# Altium schematic sheet CH32V307VCT6-R2.SchDoc
size A2
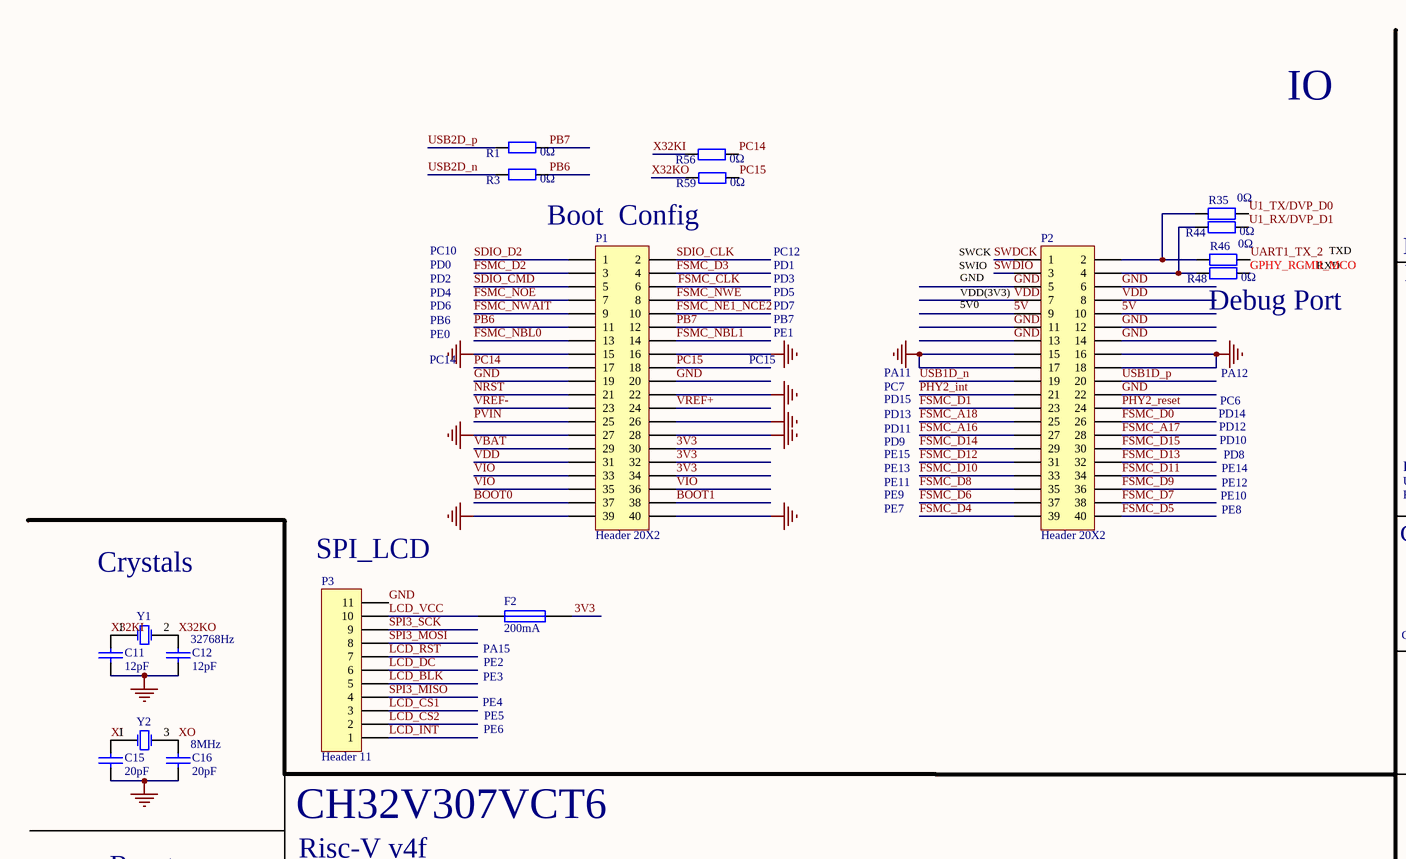
[diagram p0: CH32V307VCT6-R2.SchDoc, top left]
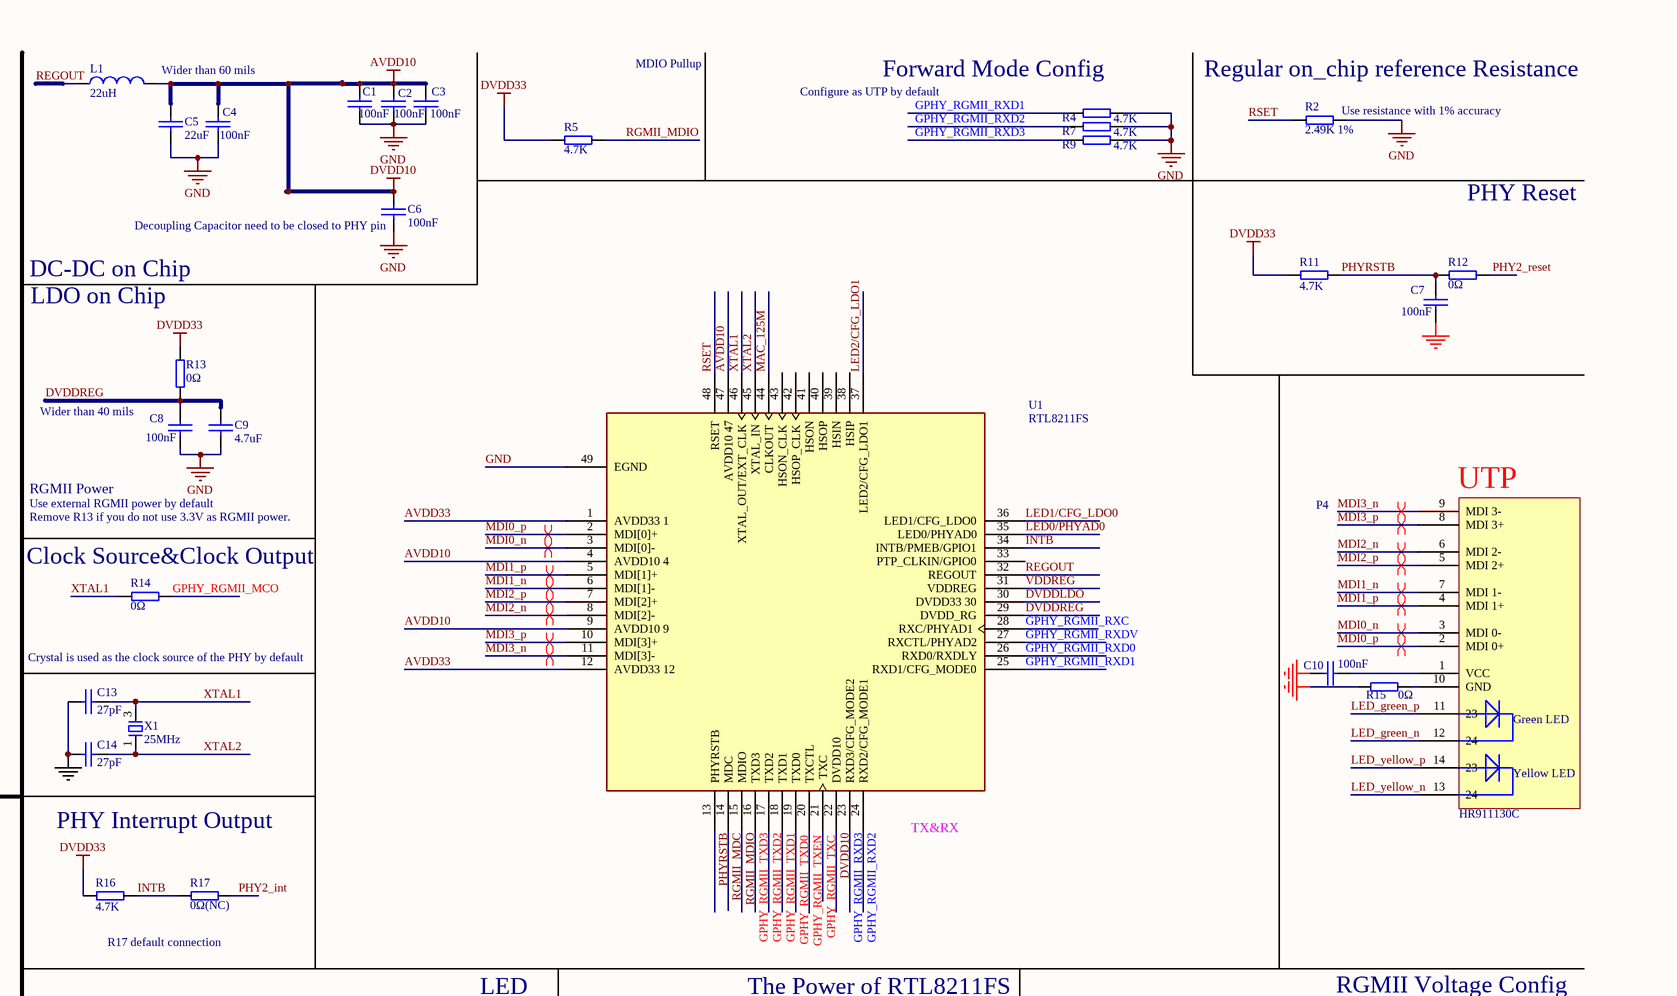
[diagram p1: CH32V307VCT6-R2.SchDoc, top right]
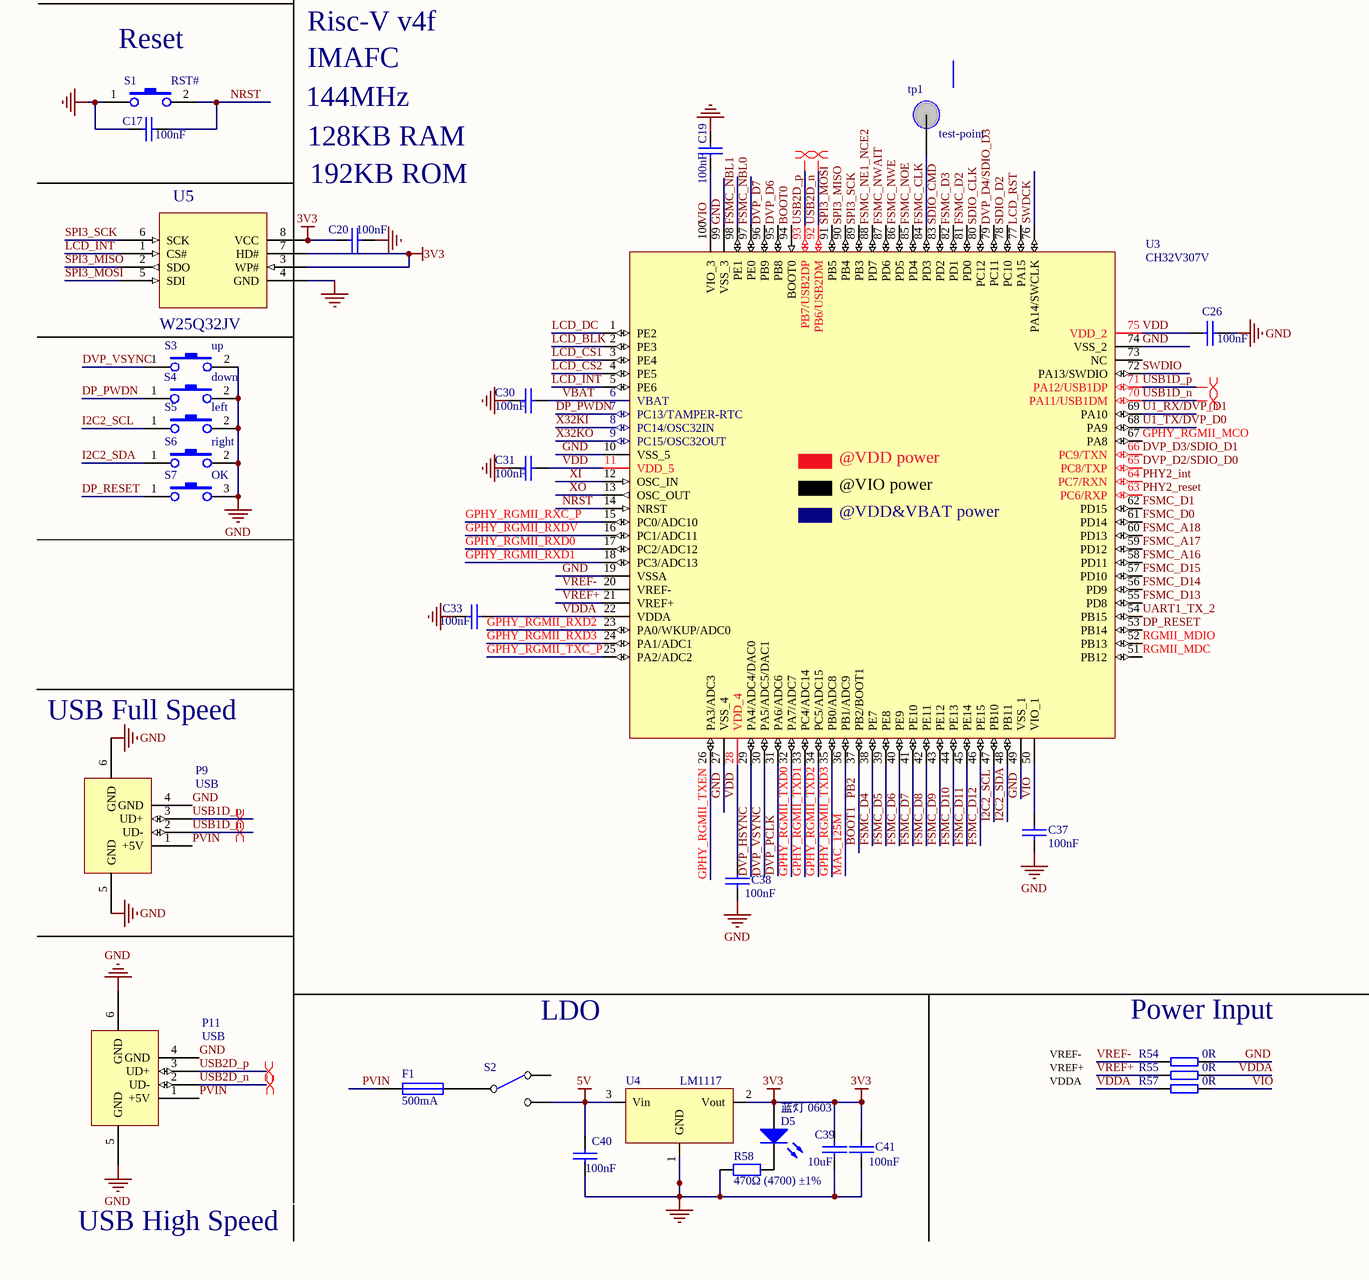
[diagram p2: CH32V307VCT6-R2.SchDoc, bottom left]
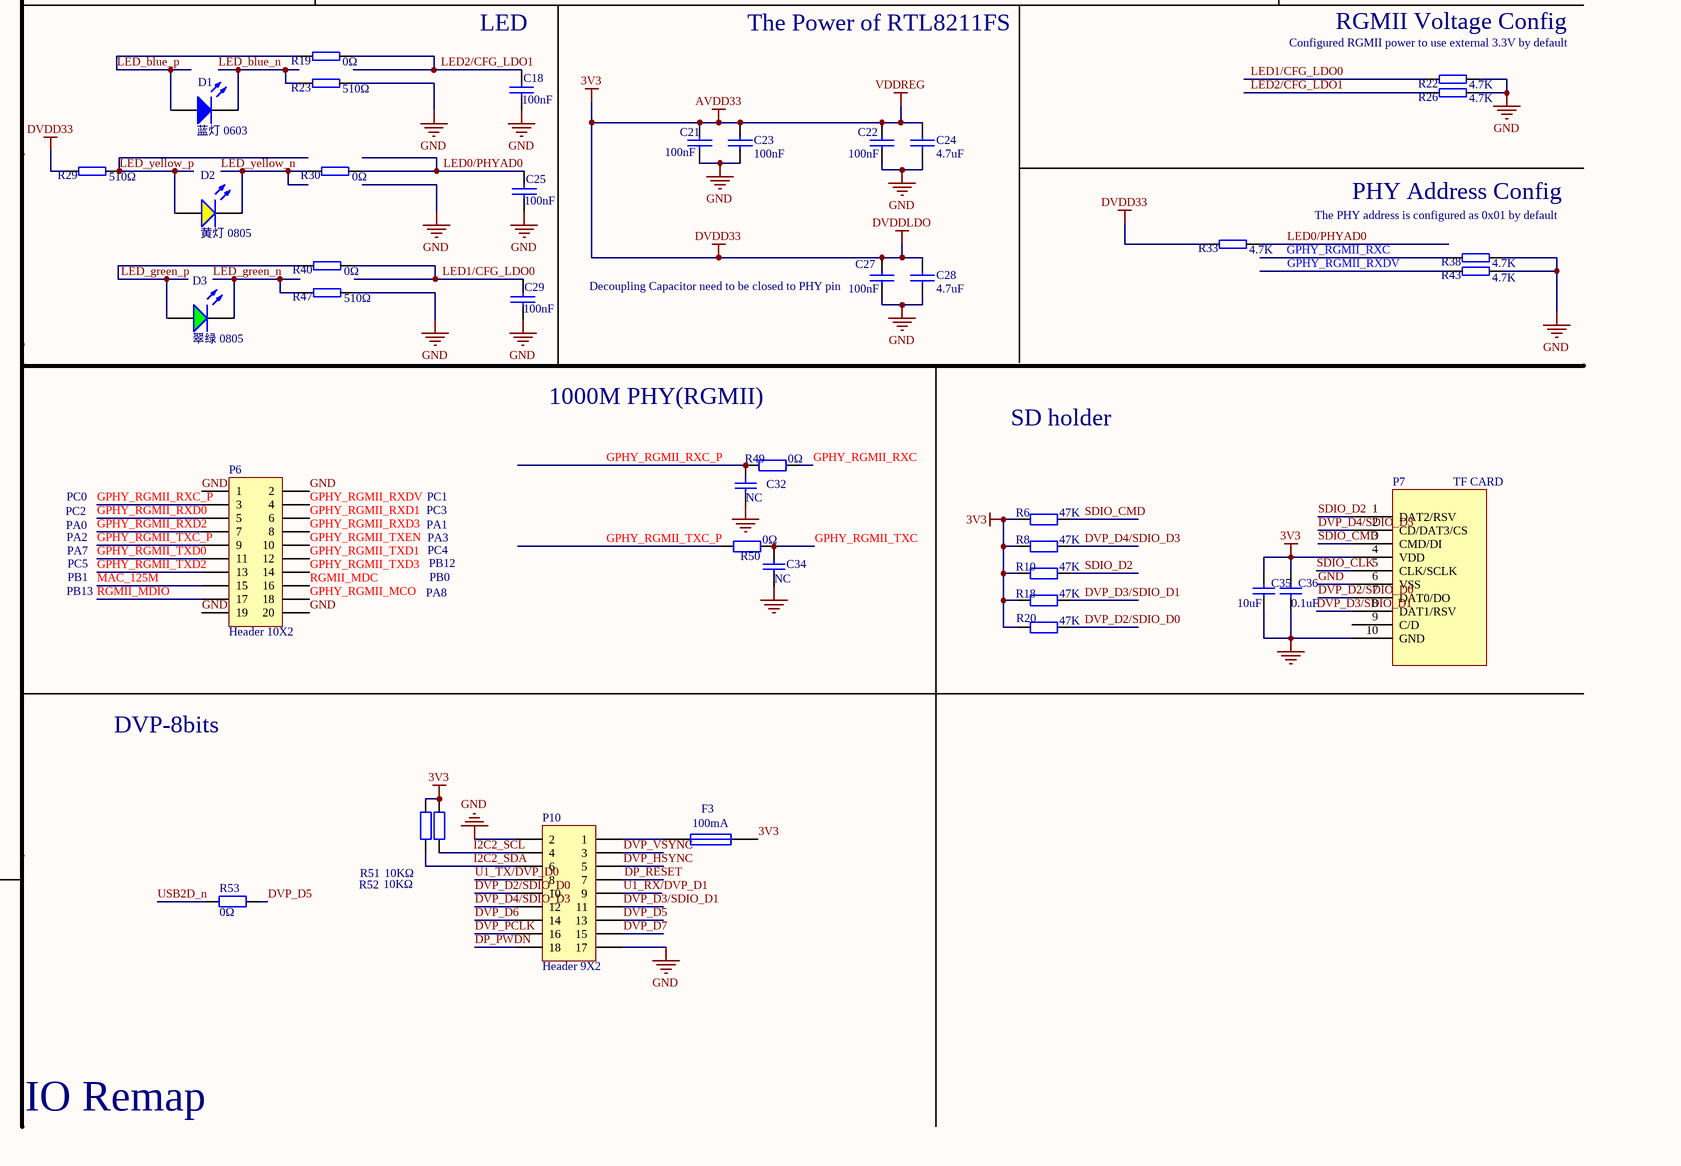
[diagram p3: CH32V307VCT6-R2.SchDoc, bottom right]

## Parts
C1  100nF  [0603_C]
C2  100nF  [0603_C]
C3  100nF  [0603_C]
C4  100nF  [0603_C]
C5  22uF  [0805_C]
C6  100nF  [0603_C]
C7  100nF  [0603_C]
C8  100nF  [0603_C]
C9  4.7uF  [0603_C]
C10  100nF  [0603_C]
C11  12pF  [0603_C]
C12  12pF  [0603_C]
C13  27pF  [0603_C]
C14  27pF  [0603_C]
C15  20pF  [0603_C]
C16  20pF  [0603_C]
C17  100nF  [0603_C]
C18  100nF  [0603_C]
C19  100nF  [0603_C]
C20  100nF  [0603_C]
C21  100nF  [0603_C]
C22  100nF  [0603_C]
C23  100nF  [0603_C]
C24  4.7uF  [0603_C]
C25  100nF  [0603_C]
C26  100nF  [0603_C]
C27  100nF  [0603_C]
C28  4.7uF  [0603_C]
C29  100nF  [0603_C]
C30  100nF  [0603_C]
C31  100nF  [0603_C]
C32  NC  [0402_C]
C33  100nF  [0603_C]
C34  NC  [0402_C]
C35  10uF  [0805_C]
C36  0.1uF  [0603_C]
C37  100nF  [0603_C]
C38  100nF  [0603_C]
C39  10uF  [0805_C]
C40  100nF  [0603_C]
C41  100nF  [0603_C]
D1  蓝灯 0603  [0603_LED_S1]
D2  黄灯 0805  [0603_LED_S1]
D3  翠绿 0805  [0603_LED_S1]
D5  蓝灯 0603  [0603_LED_S1]
F1  500mA  [0805]
F2  200mA  [0805]
F3  100mA  [0805]
L1  22uH  [0805]
P1  Header 20X2  [HDR2X20]
P2  Header 20X2  [HDR2X20]
P3  Header 11  [HDR1X11]
P4  HR911130C  [RJ45-1G]
P6  Header 10X2  [HDR2X10]
P7  TF CARD  [TF103]
P9  USB  [USBAF]
P10  Header 9X2  [HDR2X9]
P11  USB  [USBAF]
R1  0Ω  [0402]
R2  2.49K 1%  [0603_R]
R3  0Ω  [0402]
R4  4.7K  [0603_R]
R5  4.7K  [0603_R]
R6  47K  [0603_R]
R7  4.7K  [0603_R]
R8  47K  [0603_R]
R9  4.7K  [0603_R]
R10  47K  [0603_R]
R11  4.7K  [0603_R]
R12  0Ω  [0603_R]
R13  0Ω  [0603_R]
R14  0Ω  [0603_R]
R15  0Ω  [0603_R]
R16  4.7K  [0603_R]
R17  0Ω(NC)  [0603_R]
R18  47K  [0603_R]
R19  0Ω  [0603_R]
R20  47K  [0603_R]
R22  4.7K  [0603_R]
R23  510Ω  [0603_R]
R26  4.7K  [0603_R]
R29  510Ω  [0603_R]
R30  0Ω  [0603_R]
R33  4.7K  [0603_R]
R35  0Ω  [0402_R]
R38  4.7K  [0603_R]
R40  0Ω  [0603_R]
R43  4.7K  [0603_R]
R44  0Ω  [0402_R]
R46  0Ω  [0402_R]
R47  510Ω  [0603_R]
R48  0Ω  [0402_R]
R49  0Ω  [0402_R]
R50  0Ω  [0402_R]
R51  10KΩ  [0603_R]
R52  10KΩ  [0603_R]
R53  0Ω  [0402]
R54  0R  [0402]
R55  0R  [0402]
R56  0Ω  [0402]
R57  0R  [0402]
R58  470Ω (4700) ±1%  [0603_R]
R59  0Ω  [0402]
S1  RST#  [SMD_6.1x3.65x2.5mm-KEY]
S2  SW SPDT  [Horizontal Slide Switch_8.7x4.4mm-2D]  (value not drawn)
S3  up  [SMD_6.1x3.65x2.5mm-KEY]
S4  down  [SMD_6.1x3.65x2.5mm-KEY]
S5  left  [SMD_6.1x3.65x2.5mm-KEY]
S6  right  [SMD_6.1x3.65x2.5mm-KEY]
S7  OK  [KEYD]
tp1  test-point  [POINT]
U1  RTL8211FS  [QFN-48_6x6x04P]
U3  CH32V307V  [LQFP100]
U4  LM1117  [SOT-223]
U5  W25Q32JV  [SOIC-8_208mil]
X1  25MHz  [SMD-3225_4P]
Y1  32768Hz  [FC-135]
Y2  8MHz  [SMD-3225_4P]

## Nets
3V3: C20.2 C21.2 C22.2 C23.2 C24.2 C27.2 C28.2 C35.2 C36.2 C39.1 C41.1 D5.A F2.2 F3.2 P1.30 P1.32 P1.34 P7.4(VDD) R5.1 R6.2 R8.2 R10.2 R11.2 R13.2 R16.2 R18.2 R20.2 R29.1 R33.1 R51.2 R52.2 U1.1(AVDD33_1) U1.12(AVDD33_12) U1.30(DVDD33_30) U1.31(VDDREG) U4.2(Vout) U5.3(WP#) U5.7(HD#) U5.8(VCC)  [also labelled AVDD33, DVDD33, DVDDLDO, VDDREG]
5V: C40.1 P2.9 P2.10 S2.2(NC) U4.3(Vin)
AVDD10: C1.2 C2.2 C3.2 C4.2 C5.2 C6.2 L1.2 U1.4(AVDD10_4) U1.9(AVDD10_9) U1.22(DVDD10) U1.47(AVDD10_47)  [also labelled DVDD10]
GND: C1.1 C2.1 C3.1 C4.1 C5.1 C6.1 C7.1 C8.1 C9.1 C10.2 C11.1 C12.1 C13.1 C14.1 C15.1 C16.1 C17.1 C18.2 C19.2 C20.1 C21.1 C22.1 C23.1 C24.1 C25.2 C26.1 C27.1 C28.1 C29.2 C30.1 C31.2 C32.1 C33.2 C34.1 C35.1 C36.1 C37.1 C38.1 C39.2 C40.2 C41.2 P1.15 P1.16 P1.19 P1.20 P1.22 P1.26 P1.27 P1.28 P1.39 P1.40 P2.5 P2.6 P2.11 P2.12 P2.13 P2.14 P2.15 P2.16 P2.17 P2.18 P2.22 P3.11 P6.1 P6.2 P6.19 P6.20 P7.6(VSS) P7.10(GND) P9.4(GND) P9.5(GND) P9.6(GND) P10.2 P10.17 P11.4(GND) P11.5(GND) P11.6(GND) R2.2 R4.2 R7.2 R9.2 R15.2 R22.2 R23.2 R26.2 R38.2 R43.2 R47.2 R54.1 R58.1 S1.1 S3.2 S4.2 S5.2 S6.2 S7.3 U1.49(EGND) U3.10(VSS_5) U3.19(VSSA) U3.27(VSS_4) U3.49(VSS_1) U3.74(VSS_2) U3.99(VSS_3) U4.1(GND) U5.4(GND)
BOOT0: P1.37 U3.94(BOOT0)
BOOT1: P1.38 U3.37(PB2/BOOT1)  [also labelled PB2]
DP_PWDN: P10.18 S4.1 U3.7(PC13/TAMPER-RTC)
DP_RESET: P10.7 S7.1 U3.53(PB14)
DVDDREG: C8.2 C9.2 R13.1 U1.29(DVDD_RG)
DVP_D2/SDIO_D0: P7.7(DAT0/DO) P10.10 R20.1 U3.65(PC8/TXP)
DVP_D3/SDIO_D1: P7.8(DAT1/RSV) P10.11 R18.1 U3.66(PC9/TXN)
DVP_D4/SDIO_D3: P7.2(CD/DAT3/CS) P10.12 R8.1 U3.79(PC11)
DVP_D5: P10.13 R53.2
DVP_D6: P10.14 U3.95(PB8)
DVP_D7: P10.15 U3.96(PB9)
DVP_HSYNC: P10.5 U3.29(PA4/ADC4/DAC0)
DVP_PCLK: P10.16 U3.31(PA6/ADC6)
DVP_VSYNC: P10.3 S3.1 U3.30(PA5/ADC5/DAC1)
FSMC_A16: P2.27 U3.58(PD11)
FSMC_A17: P2.28 U3.59(PD12)
FSMC_A18: P2.25 U3.60(PD13)
FSMC_CLK: P1.6 tp1.1(point) U3.84(PD3)
FSMC_D0: P2.26 U3.61(PD14)
FSMC_D1: P2.23 U3.62(PD15)
FSMC_D2: P1.3 U3.81(PD0)
FSMC_D3: P1.4 U3.82(PD1)
FSMC_D4: P2.39 U3.38(PE7)
FSMC_D5: P2.40 U3.39(PE8)
FSMC_D6: P2.37 U3.40(PE9)
FSMC_D7: P2.38 U3.41(PE10)
FSMC_D8: P2.35 U3.42(PE11)
FSMC_D9: P2.36 U3.43(PE12)
FSMC_D10: P2.33 U3.44(PE13)
FSMC_D11: P2.34 U3.45(PE14)
FSMC_D12: P2.31 U3.46(PE15)
FSMC_D13: P2.32 U3.55(PD8)
FSMC_D14: P2.29 U3.56(PD9)
FSMC_D15: P2.30 U3.57(PD10)
FSMC_NBL0: P1.13 U3.97(PE0)
FSMC_NBL1: P1.14 U3.98(PE1)
FSMC_NE1_NCE2: P1.10 U3.88(PD7)
FSMC_NOE: P1.7 U3.85(PD4)
FSMC_NWAIT: P1.9 U3.87(PD6)
FSMC_NWE: P1.8 U3.86(PD5)
GPHY_RGMII_MCO: P6.18 R14.2 R48.2 U3.67(PA8)
GPHY_RGMII_RXC: R38.1 R49.1 U1.28(RXC/PHYAD1)
GPHY_RGMII_RXC_P: C32.2 P6.3 R49.2 U3.15(PC0/ADC10)
GPHY_RGMII_RXD0: P6.5 U1.26(RXD0/RXDLY) U3.17(PC2/ADC12)
GPHY_RGMII_RXD1: P6.6 R4.1 U1.25(RXD1/CFG_MODE0) U3.18(PC3/ADC13)
GPHY_RGMII_RXD2: P6.7 R7.1 U1.24(RXD2/CFG_MODE1) U3.23(PA0/WKUP/ADC0)
GPHY_RGMII_RXD3: P6.8 R9.1 U1.23(RXD3/CFG_MODE2) U3.24(PA1/ADC1)
GPHY_RGMII_RXDV: P6.4 R43.1 U1.27(RXCTL/PHYAD2) U3.16(PC1/ADC11)
GPHY_RGMII_TXC: C34.2 R50.1 U1.21(TXC)
GPHY_RGMII_TXC_P: P6.9 R50.2 U3.25(PA2/ADC2)
GPHY_RGMII_TXD0: P6.11 U1.19(TXD0) U3.32(PA7/ADC7)
GPHY_RGMII_TXD1: P6.12 U1.18(TXD1) U3.33(PC4/ADC14)
GPHY_RGMII_TXD2: P6.13 U1.17(TXD2) U3.34(PC5/ADC15)
GPHY_RGMII_TXD3: P6.14 U1.16(TXD3) U3.35(PB0/ADC8)
GPHY_RGMII_TXEN: P6.10 U1.20(TXCTL) U3.26(PA3/ADC3)
I2C2_SCL: P10.4 R51.1 S5.1 U3.47(PB10)
I2C2_SDA: P10.6 R52.1 S6.1 U3.48(PB11)
INTB: R16.1 R17.1 U1.34(INTB/PMEB/GPIO1)
LCD_BLK: P3.5 U3.2(PE3)
LCD_CS1: P3.3 U3.3(PE4)
LCD_CS2: P3.2 U3.4(PE5)
LCD_DC: P3.6 U3.1(PE2)
LCD_INT: P3.1 U3.5(PE6) U5.1(CS#)
LCD_RST: P3.7 U3.77(PA15)
LCD_VCC: F2.1 P3.10
LED0/PHYAD0: C25.1 R30.2 R33.2 U1.35(LED0/PHYAD0)
LED1/CFG_LDO0: C29.1 R22.1 R40.2 U1.36(LED1/CFG_LDO0)
LED2/CFG_LDO1: C18.1 R19.2 R26.1 U1.37(LED2/CFG_LDO1)
LED_blue_n: D1.K R23.1
LED_blue_p: D1.A R19.1
LED_green_n: D3.K P4.12(24) R47.1
LED_green_p: D3.A P4.11(23) R40.1
LED_yellow_n: D2.K P4.13(24) R30.1
LED_yellow_p: D2.A P4.14(23) R29.2
MAC_125M: P6.15 U1.44(CLKOUT) U3.36(PB1/ADC9)
MDI0_n: P4.3(MDI_0-) U1.3(MDI[0]-)
MDI0_p: P4.2(MDI_0+) U1.2(MDI[0]+)
MDI1_n: P4.7(MDI_1-) U1.6(MDI[1]-)
MDI1_p: P4.4(MDI_1+) U1.5(MDI[1]+)
MDI2_n: P4.6(MDI_2-) U1.8(MDI[2]-)
MDI2_p: P4.5(MDI_2+) U1.7(MDI[2]+)
MDI3_n: P4.9(MDI_3-) U1.11(MDI[3]-)
MDI3_p: P4.8(MDI_3+) U1.10(MDI[3]+)
NRST: C17.2 P1.21 S1.2 U3.14(NRST)
PB6: P1.11 R3.2
PB7: P1.12 R1.2
PC14: P1.17 R56.2
PC15: P1.18 R59.2
PHY2_int: P2.21 R17.2 U3.64(PC7/RXN)
PHY2_reset: P2.24 R12.2 U3.63(PC6/RXP)
PHYRSTB: C7.2 R11.1 R12.1 U1.13(PHYRSTB)
PVIN: F1.1 P1.25 P9.1(+5V) P11.1(+5V)
REGOUT: L1.1 U1.32(REGOUT)
RGMII_MDC: P6.16 U1.14(MDC) U3.51(PB12)
RGMII_MDIO: P6.17 R5.2 U1.15(MDIO) U3.52(PB13)
RSET: R2.1 U1.48(RSET)
SDIO_CLK: P1.2 P7.5(CLK/SCLK) U3.80(PC12)
SDIO_CMD: P1.5 P7.3(CMD/DI) R6.1 U3.83(PD2)
SDIO_D2: P1.1 P7.1(DAT2/RSV) R10.1 U3.78(PC10)
SPI3_MISO: P3.4 U3.90(PB4) U5.2(SDO)
SPI3_MOSI: P3.8 U3.91(PB5) U5.5(SDI)
SPI3_SCK: P3.9 U3.89(PB3) U5.6(SCK)
SWDCK: P2.1 U3.76(PA14/SWCLK)
SWDIO: P2.3 U3.72(PA13/SWDIO)
U1_RX/DVP_D1: P10.9 R44.2 U3.69(PA10)
U1_TX/DVP_D0: P10.8 R35.2 U3.68(PA9)
UART1_TX_2: R46.2 U3.54(PB15)
USB1D_n: P2.19 P9.2(UD-) U3.70(PA11/USB1DM)
USB1D_p: P2.20 P9.3(UD+) U3.71(PA12/USB1DP)
USB2D_n: P11.2(UD-) R3.1 R53.1 U3.92(PB6/USB2DM)
USB2D_p: P11.3(UD+) R1.1 U3.93(PB7/USB2DP)
VBAT: C30.2 P1.29 U3.6(VBAT)
VDD: C26.2 C31.1 C38.2 P1.31 P2.7 P2.8 U3.11(VDD_5) U3.28(VDD_4) U3.75(VDD_2)
VDDA: C33.1 R55.1 R57.2 U3.22(VDDA)
VIO: C19.1 C37.2 P1.33 P1.35 P1.36 R57.1 U3.50(VIO_1) U3.100(VIO_3)
VREF+: P1.24 R55.2 U3.21(VREF+)
VREF-: P1.23 R54.2 U3.20(VREF-)
X32KI: C11.2 R56.1 U3.8(PC14/OSC32IN) Y1.1(OSC1)
X32KO: C12.2 R59.1 U3.9(PC15/OSC32OUT) Y1.2(OSC2)
XI: C15.2 U3.12(OSC_IN) Y2.1(OSC1)
XO: C16.2 U3.13(OSC_OUT) Y2.3(OSC2)
XTAL1: C13.2 R14.1 U1.46(XTAL_OUT/EXT_CLK) X1.3
XTAL2: C14.2 U1.45(XTAL_IN) X1.1
NetC10_1: C10.1 P4.1(VCC)
NetD5_K: D5.K R58.2
NetF1_2: F1.2 S2.1(COMMON)
NetF3_1: F3.1 P10.1
NetP2_2: P2.2 R35.1 R46.1
NetP2_4: P2.4 R44.1 R48.1
NetP4_10: P4.10(GND) R15.1

Not connected (* = marked no-connect by the designer): P7 9(C/D); S2 3(NO); U1 33(PTP_CLKIN/GPIO0) 38(HSIP) 39(HSIN) 40(HSOP) 41(HSON) 42(HSOP_CLK) 43(HSON_CLK); U3 73(NC)

## Layout directives
differential pair: MDI0_n, MDI0_p, MDI1_n, MDI1_p, MDI2_n, MDI2_p, MDI3_n, MDI3_p, USB1D_n, USB1D_p, USB2D_n, USB2D_p

## Notes on the sheet
- MDIO Pullup
- IO
- (near L1) Wider than 60 mils
- Configure as UTP by default
- Forward Mode Config
- (near R2) Regular on_chip reference Resistance
- (near R2) Use resistance with 1% accuracy
- Boot  Config
- (near C6) Decoupling Capacitor need to be closed to PHY pin
- PHY Reset
- PC10
- PD2
- PD0
- PD4
- PD6
- PD7
- PD5
- PD3
- PD1
- PC12
- SWCK
- SWIO
- (near P2) VDD(3V3)
- 5V0
- GND
- (near R48) Debug Port
- RXD
- TXD
- DC-DC on Chip
- (near R13) LDO on Chip
- PC14
- PB6
- PE0
- PC15
- PE1
- PB7
- PA11
- PA12
- PC7
- PD15
- PD13
- PD11
- PD9
- PD14
- PD12
- PD10
- PC6
- Wider than 40 mils
- PE15
- PE13
- PE11
- PE9
- PE7
- PE10
- PE12
- PE14
- PE8
- PD8
- RGMII Power
- Use external RGMII power by default
- Remove R13 if you do not use 3.3V as RGMII power.
- (near P4) UTP
- Crystals
- (near P3) SPI_LCD
- (near R14) Clock Source&Clock Output
- (near F2) PA15
- Crystal is used as the clock source of the PHY by default
- PE4
- PE3
- (near F2) PE2
- PE5
- PE6
- (near P3) CH32V307VCT6
- PHY Interrupt Output
- (near U1) TX&RX
- Reset
- Risc-V v4f
- IMAFC
- 144MHz
- 128KB RAM
- R17 default connection
- (near C18) LED
- The Power of RTL8211FS
- Configured RGMII power to use external 3.3V by default
- RGMII Voltage Config
- 192KB ROM
- The PHY address is configured as 0x01 by default
- PHY Address Config
- (near C27) Decoupling Capacitor need to be closed to PHY pin
- 1000M PHY(RGMII)
- SD holder
- PC2
- PC0
- PC3
- PC1
- PA0
- PA2
- PA7
- PB1
- PC5
- PA1
- PC4
- PA3
- PB12
- PB0
- (near P9) USB Full Speed
- PB13
- PA8
- DVP-8bits
- (near S2) LDO
- Power Input
- VREF-
- VREF+
- VDDA
- USB High Speed
- IO Remap
- (in symbol CH32V307V) @VDD power; @VIO power; @VDD&VBAT power
- (in symbol HR911130C) Green LED; Yellow LED
- (in symbol RTL8211FS(I)) RTL8211FS(I)(-VS)

## Library data of the parts
C1-C31 C33 C37-C41 = CAP: Capacitor
C32 C34 = 0603 2.7pF (2R7) 0.25pF 50V: 贴片电容; ComponentLink1Description: 供应商链接; ComponentLink1URL: http://www.szlcsc.com/product/details_16831.html; Package: 0603; Supplier: LC; SuppliersPartNumber: C16149
C35 C36 = Cap: Capacitor; Revision: July-2002: Re-released for DXP Platform.
D1 D5 = 0603 蓝灯: 发光二极管; ComponentLink1Description: 供应商链接; ComponentLink1URL: http://www.szlcsc.com/product/details_73150.html; Package: 0603; Supplier: LC; SuppliersPartNumber: C72041
D2 = 0805 黄灯: 发光二极管; ComponentLink1Description: 供应商链接; ComponentLink1URL: http://www.szlcsc.com/product/details_2669.html; Package: 0805; Supplier: LC; SuppliersPartNumber: C2296
D3 = 0805 翠绿: 发光二极管; ComponentLink1Description: 供应商链接; ComponentLink1URL: http://www.szlcsc.com/product/details_2670.html; Package: 0805; Supplier: LC; SuppliersPartNumber: C2297
F1-F3 = Fuse 1: Fuse; Published: 8-Jun-2000; LatestRevisionDate: 17-Jul-2002; LatestRevisionNote: Re-released for DXP Platform.; PackageReference: PIN-W2/E2.8; Publisher: Altium Limited; PackageDescription: Thru-Hole; 2 Leads
L1 = Inductor: Published: 8-Jun-2000; LatestRevisionDate: 29-May-2009; LatestRevisionNote: IPC-7351 Footprint Added.; PackageReference: 0402-A; Publisher: Altium Limited; PackageDescription: Chip Inductor
P1 P2 = Header 20X2: Header, 20-Pin, Dual row; LatestRevisionDate: 17-Jul-2002; LatestRevisionNote: Re-released for DXP Platform.; Publisher: Altium Limited
P3 = Header 11: Header, 11-Pin; LatestRevisionDate: 17-Jul-2002; LatestRevisionNote: Re-released for DXP Platform.; Publisher: Altium Limited
P6 = Header 10X2: Header, 10-Pin, Dual row; LatestRevisionDate: 17-Jul-2002; LatestRevisionNote: Re-released for DXP Platform.; Publisher: Altium Limited
P7 = TF_自弹
P9 P11 = USB: USB Port
P10 = Header 9X2: Header, 9-Pin, Dual row; LatestRevisionDate: 17-Jul-2002; LatestRevisionNote: Re-released for DXP Platform.; Publisher: Altium Limited
R1 R3 R35 R44 R46 R48 R53 R56 R59 = 0402 0Ω (0R0) 1%: 贴片电阻; ComponentLink1Description: 供应商链接; ComponentLink1URL: http://www.szlcsc.com/product/details_17853.html; Package: 0402; Supplier: LC; SuppliersPartNumber: C17168
R2 R4 R5 R7 R9 R11-R17 R19 R22 R23 R26 R29 R30 R33 R38 R40 R43 R47 = Res
R6 R8 R10 R18 R20 R49 R50 = Res2: Resistor; PackageDescription: Axial Device, Thru-Hole; 2 Leads; 0.4 in Pin Spacing
R51 R52 = 0603 10KΩ (1002) 1%: 贴片电阻; ComponentLink1Description: 供应商链接; ComponentLink1URL: http://www.szlcsc.com/product/details_26547.html; Package: 0603; Supplier: LC; SuppliersPartNumber: C25804
R54 R55 R57 = R
R58 = 0603 470Ω (4700) 1%: 贴片电阻; ComponentLink1Description: 供应商链接; ComponentLink1URL: http://www.szlcsc.com/product/details_23906.html; Package: 0603; Supplier: LC; SuppliersPartNumber: C23179
S1 S3-S7 = KEY1
tp1 = test-point: 测试点
U1 = RTL8211FS(I): 千兆以太网物理层芯片; pin to pad: 49>0
U3 = CH32V307V: RISC-V FPU HD-MCU, 144MHz, USB_480M, USB OTG, 1000M Ethernet MAC, 2*CAN, FSMC+DVP
U4 = 6219P33M
U5 = Pro89C.tmp_25F512_2
X1 = XTAL-2P: 2脚无源脚晶振; BOM名称: 2脚无源脚晶振
Y1 Y2 = XTAL: Crystal Oscillator; Published: 8-Jun-2000; LatestRevisionDate: 17-Jul-2002; LatestRevisionNote: Re-released for DXP Platform.; PackageReference: R38; Publisher: Altium Limited; PackageDescription: Crystal, Thru-Hole; 2 Leads; Body 3.1 x 8.2 mm (Dia.xH)